# Altium project NVME-IPEXVer0.1.PrjPcb
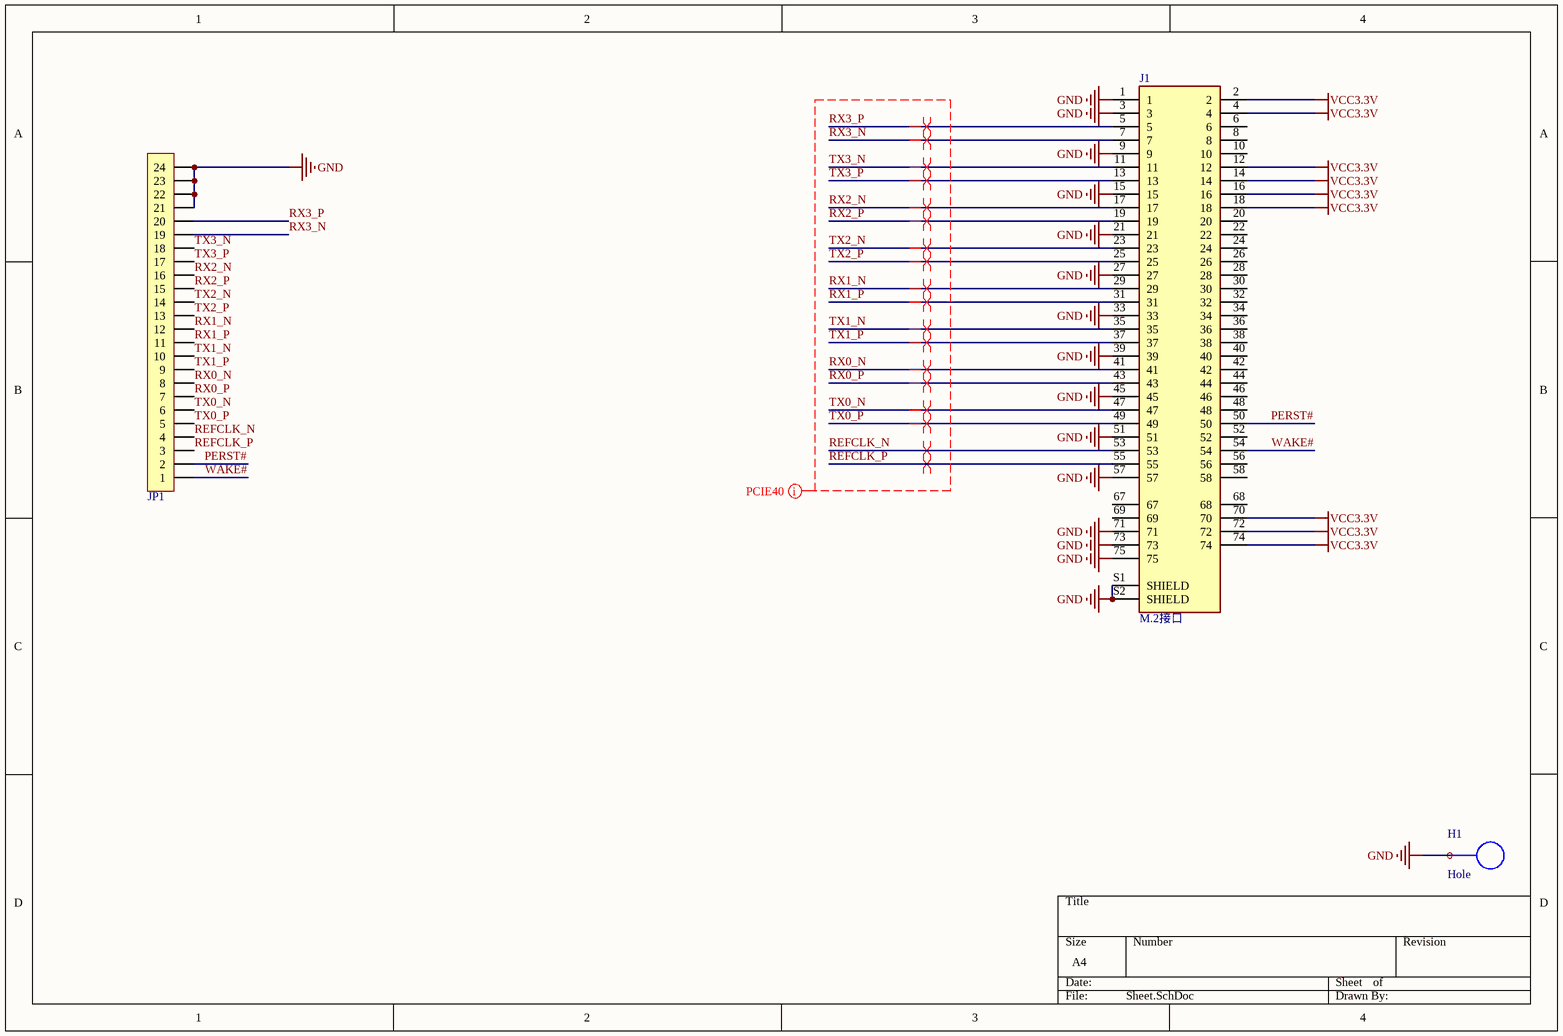
[diagram p0: Sheet.SchDoc]
1 sheet, 3 parts. Net scope: global (net labels, ports and power ports of the same name join across sheets).
Board file: PCB.PcbDoc

## Sheet Sheet.SchDoc
size A4; SheetNumber: 1; SheetTotal: 1

### Parts
H1  Hole  [M3x4+6_N]
J1  M.2接口  [M.2 M KEY PcbEdge]
JP1  FPC1.0-24P  [CONN-SMD_20P-P0.50_I-PEX_20455-020E-02]  (value not drawn)

### Nets
GND: H1.?1 J1.1 J1.3 J1.9 J1.15 J1.21 J1.27 J1.33 J1.39 J1.45 J1.51 J1.57 J1.71 J1.73 J1.75 J1.S1(SHIELD) J1.S2(SHIELD) JP1.21 JP1.22 JP1.23 JP1.24
VCC3.3V: J1.2 J1.4 J1.12 J1.14 J1.16 J1.18 J1.70 J1.72 J1.74
PERST#: J1.50 JP1.2
REFCLK_N: J1.53 JP1.4
REFCLK_P: J1.55 JP1.3
RX0_N: J1.41 JP1.8
RX0_P: J1.43 JP1.7
RX1_N: J1.29 JP1.12
RX1_P: J1.31 JP1.11
RX2_N: J1.17 JP1.16
RX2_P: J1.19 JP1.15
RX3_N: J1.7 JP1.19
RX3_P: J1.5 JP1.20
TX0_N: J1.47 JP1.6
TX0_P: J1.49 JP1.5
TX1_N: J1.35 JP1.10
TX1_P: J1.37 JP1.9
TX2_N: J1.23 JP1.14
TX2_P: J1.25 JP1.13
TX3_N: J1.11 JP1.18
TX3_P: J1.13 JP1.17
WAKE#: J1.54 JP1.1

Not connected (* = marked no-connect by the designer): J1 6 8 10 20 22 24 26 28 30 32 34 36 38 40 42 44 46 48 52 56 58 67 68 69

### Layout directives
differential pair: REFCLK_N, REFCLK_P, RX0_N, RX0_P, RX1_N, RX1_P, RX2_N, RX2_P, RX3_N, RX3_P, TX0_N, TX0_P, TX1_N, TX1_P, TX2_N, TX2_P, TX3_N, TX3_P
net class PICE; rule Differential Pairs Routing [Pref Gap = 6mil    Min Gap  = 6mil    Max Gap  = 10milPref Width = 6.3mil    Min Width  = 6.3mil    Max Width  = 15mil]: REFCLK_N, REFCLK_P, RX0_N, RX0_P, RX1_N, RX1_P, RX2_N, RX2_P, RX3_N, RX3_P, TX0_N, TX0_P, TX1_N, TX1_P, TX2_N, TX2_P, TX3_N, TX3_P

### Library data of the parts
H1 = Hole: 铜柱孔; 版权归属: 源创客; BOM名称: 铜柱孔; 学习资源: www.ooocke.com
J1 = M.2接口: MF: Amphenol ICC (FCI); MP: MDT420M01002; Package: None; Price: None; Value: *; Availability: Unavailable
JP1 = FPC-24P: FPC连接器; 版权归属: 源创客; BOM名称: FPC连接器; 学习资源: www.ooocke.com